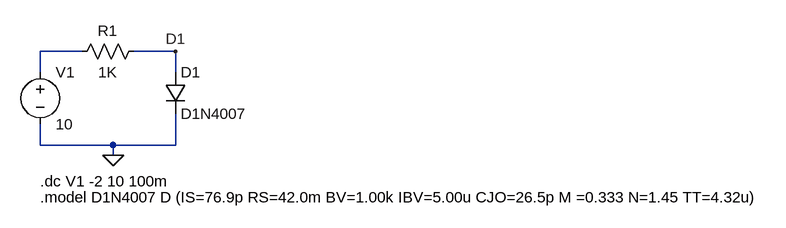
[diagram p0: schematic TP2_1.asc]
TP2_1.asc, the LTspice schematic file:
Version 4.1
SHEET 1 1324 680
WIRE 176 128 112 128
WIRE 320 128 256 128
WIRE 112 160 112 128
WIRE 320 160 320 128
WIRE 112 272 112 240
WIRE 224 272 112 272
WIRE 320 272 320 224
WIRE 320 272 224 272
WIRE 224 288 224 272
FLAG 224 288 0
FLAG 320 128 D1
SYMBOL res 272 112 R90
WINDOW 0 0 56 VBottom 2
WINDOW 3 32 56 VTop 2
SYMATTR InstName R1
SYMATTR Value 1K
SYMBOL diode 304 160 R0
SYMATTR InstName D1
SYMATTR Value D1N4007
SYMBOL voltage 112 144 R0
WINDOW 123 0 0 Left 0
WINDOW 39 0 0 Left 0
SYMATTR InstName V1
SYMATTR Value 10
TEXT 112 328 Left 2 !.dc V1 -2 10 100m
TEXT 112 352 Left 2 !.model D1N4007 D (IS=76.9p RS=42.0m BV=1.00k IBV=5.00u CJO=26.5p M =0.333 N=1.45 TT=4.32u)

The netlist it stands for:
* TP2_1.asc
R1 D1 N001 1K
D1 D1 0 D1N4007
V1 N001 0 10
.model D D
.lib standard.dio
.dc V1 -2 10 100m
.model D1N4007 D (IS=76.9p RS=42.0m BV=1.00k IBV=5.00u CJO=26.5p M =0.333 N=1.45 TT=4.32u)
.backanno
.end